# EAGLE schematic 4-20ma (EAGLE 9.2.0)
AUTHOR: Jared Wolff; BOARD_NUMBER: BRD-0005; COMPANY: Circuit Dojo; DOC_NUMBER: SCH-0005; DOC_REV: 1

## Sheet 1 of 2
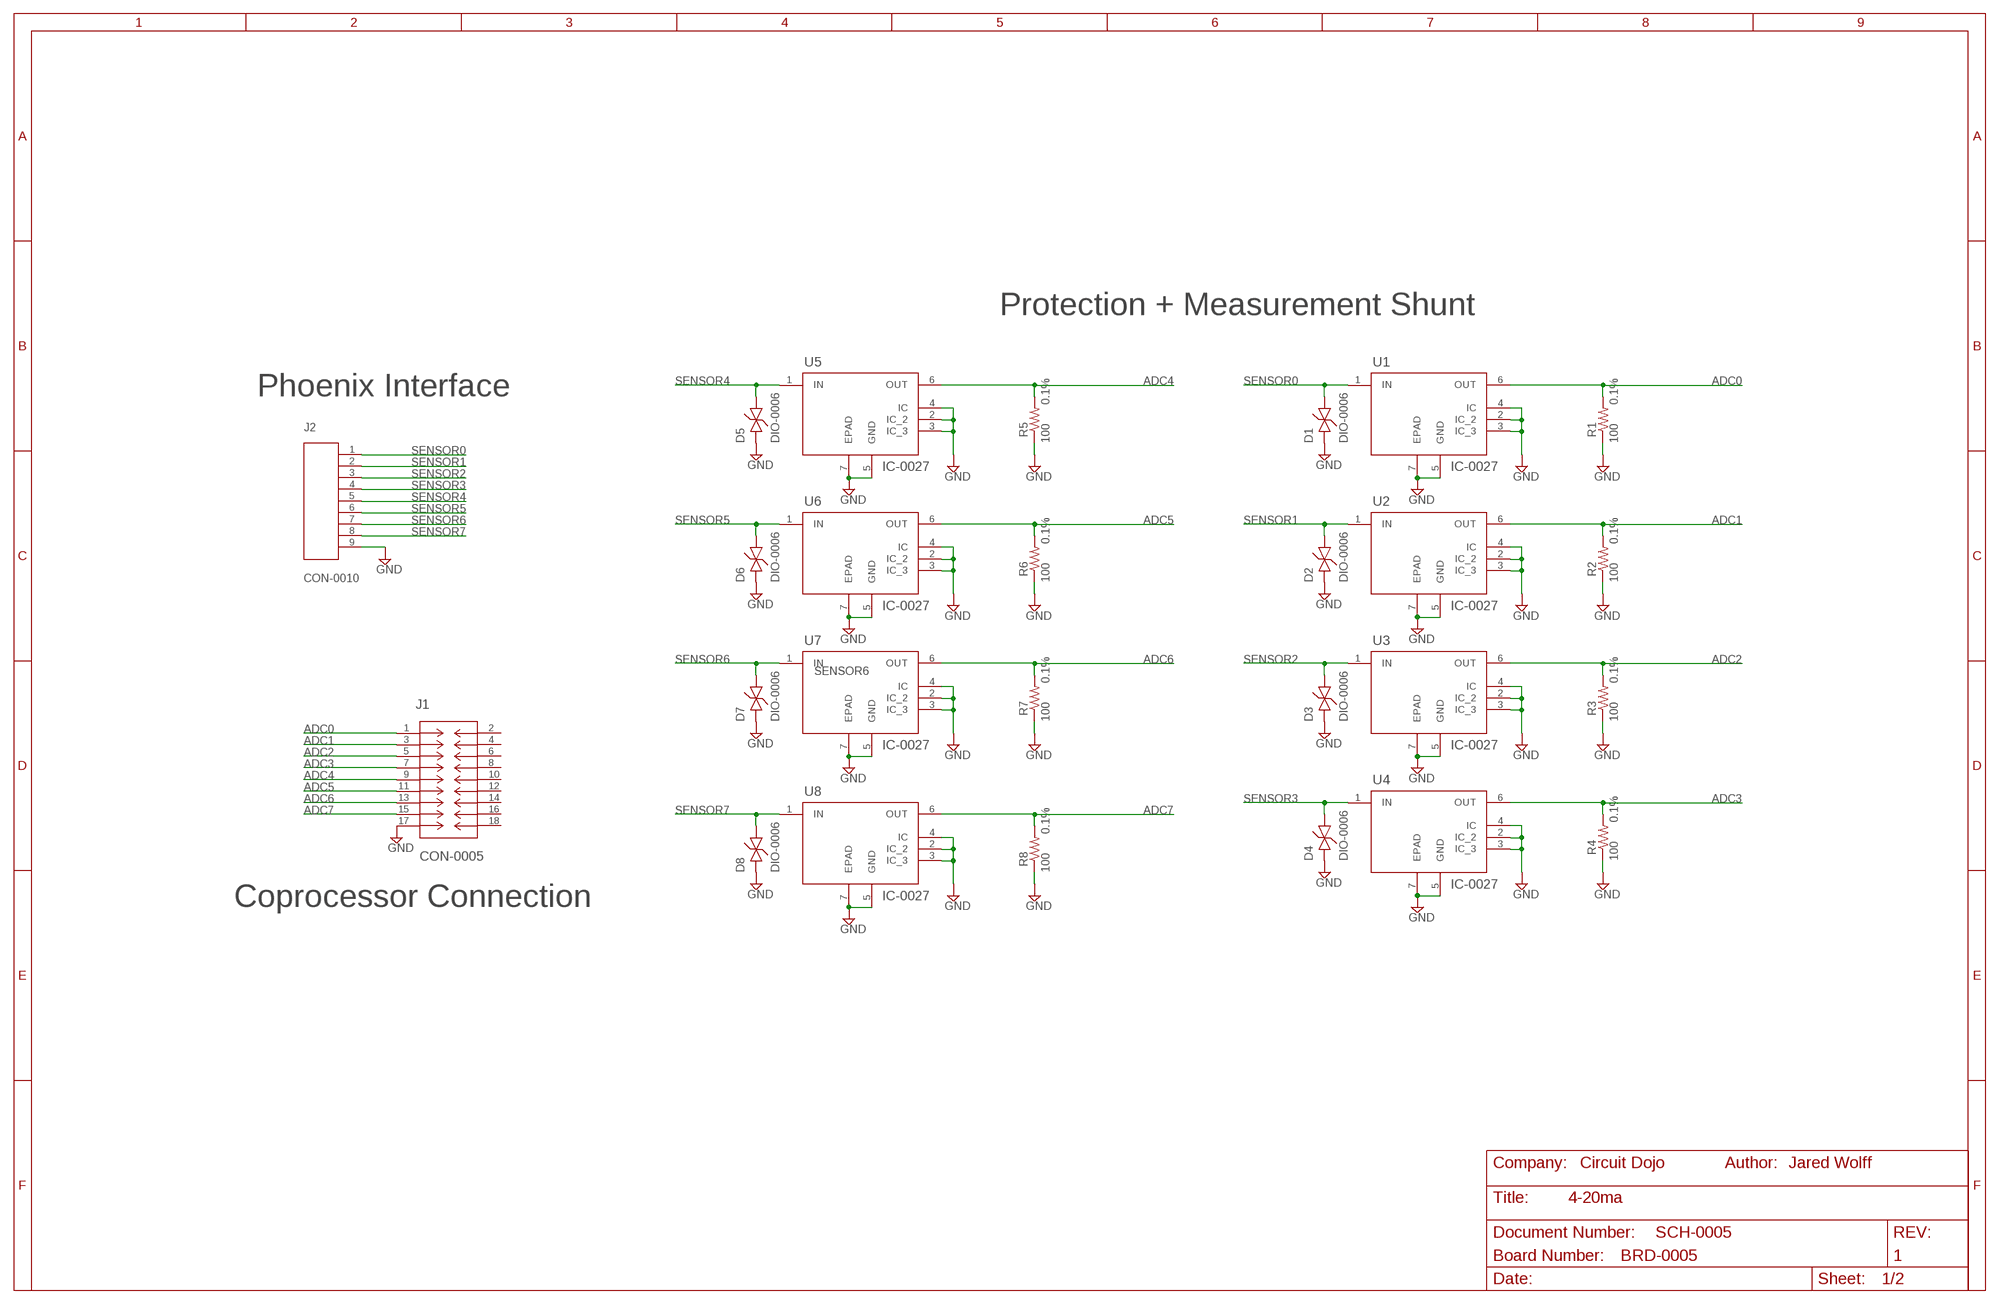
[diagram p0: schematic, sheet 1]

### Parts
D1  DIO-0006  [SMASERIES]
D2  DIO-0006  [SMASERIES]
D3  DIO-0006  [SMASERIES]
D4  DIO-0006  [SMASERIES]
D5  DIO-0006  [SMASERIES]
D6  DIO-0006  [SMASERIES]
D7  DIO-0006  [SMASERIES]
D8  DIO-0006  [SMASERIES]
J1  CON-0005  [CON18_2X9_TU_SSQ]
J2  CON-0010  [CON-B9B-ZR]
R1  100  RES-0034  [R0603]
R2  100  RES-0034  [R0603]
R3  100  RES-0034  [R0603]
R4  100  RES-0034  [R0603]
R5  100  RES-0034  [R0603]
R6  100  RES-0034  [R0603]
R7  100  RES-0034  [R0603]
R8  100  RES-0034  [R0603]
U1  IC-0027  [21-0137I_T633-2]
U2  IC-0027  [21-0137I_T633-2]
U3  IC-0027  [21-0137I_T633-2]
U4  IC-0027  [21-0137I_T633-2]
U5  IC-0027  [21-0137I_T633-2]
U6  IC-0027  [21-0137I_T633-2]
U7  IC-0027  [21-0137I_T633-2]
U8  IC-0027  [21-0137I_T633-2]

### Nets
ADC0: J1.1 R1.2 U1.6(OUT)
ADC1: J1.3 R2.2 U2.6(OUT)
ADC2: J1.5 R3.2 U3.6(OUT)
ADC3: J1.7 R4.2 U4.6(OUT)
ADC4: J1.9 R5.2 U5.6(OUT)
ADC5: J1.11 R6.2 U6.6(OUT)
ADC6: J1.13 R7.2 U7.6(OUT)
ADC7: J1.15 R8.2 U8.6(OUT)
GND: D1.1 D2.1 D3.1 D4.1 D5.1 D6.1 D7.1 D8.1 J1.17 J2.9 R1.1 R2.1 R3.1 R4.1 R5.1 R6.1 R7.1 R8.1 U1.2(IC_2) U1.3(IC_3) U1.4(IC) U1.5(GND) U1.7(EPAD) U2.2(IC_2) U2.3(IC_3) U2.4(IC) U2.5(GND) U2.7(EPAD) U3.2(IC_2) U3.3(IC_3) U3.4(IC) U3.5(GND) U3.7(EPAD) U4.2(IC_2) U4.3(IC_3) U4.4(IC) U4.5(GND) U4.7(EPAD) U5.2(IC_2) U5.3(IC_3) U5.4(IC) U5.5(GND) U5.7(EPAD) U6.2(IC_2) U6.3(IC_3) U6.4(IC) U6.5(GND) U6.7(EPAD) U7.2(IC_2) U7.3(IC_3) U7.4(IC) U7.5(GND) U7.7(EPAD) U8.2(IC_2) U8.3(IC_3) U8.4(IC) U8.5(GND) U8.7(EPAD) ; also sheet 2
SENSOR0: D1.2 J2.1 U1.1(IN)
SENSOR1: D2.2 J2.2 U2.1(IN)
SENSOR2: D3.2 J2.3 U3.1(IN)
SENSOR3: D4.2 J2.4 U4.1(IN)
SENSOR4: D5.2 J2.5 U5.1(IN)
SENSOR5: D6.2 J2.6 U6.1(IN)
SENSOR6: D7.2 J2.7 U7.1(IN)
SENSOR7: D8.2 J2.8 U8.1(IN)
Unconnected: J1.2 J1.4 J1.6 J1.8 J1.10 J1.12 J1.14 J1.16 J1.18

### Notes on the sheet
- Protection + Measurement Shunt
- Phoenix Interface
- Coprocessor Connection

## Sheet 2 of 2
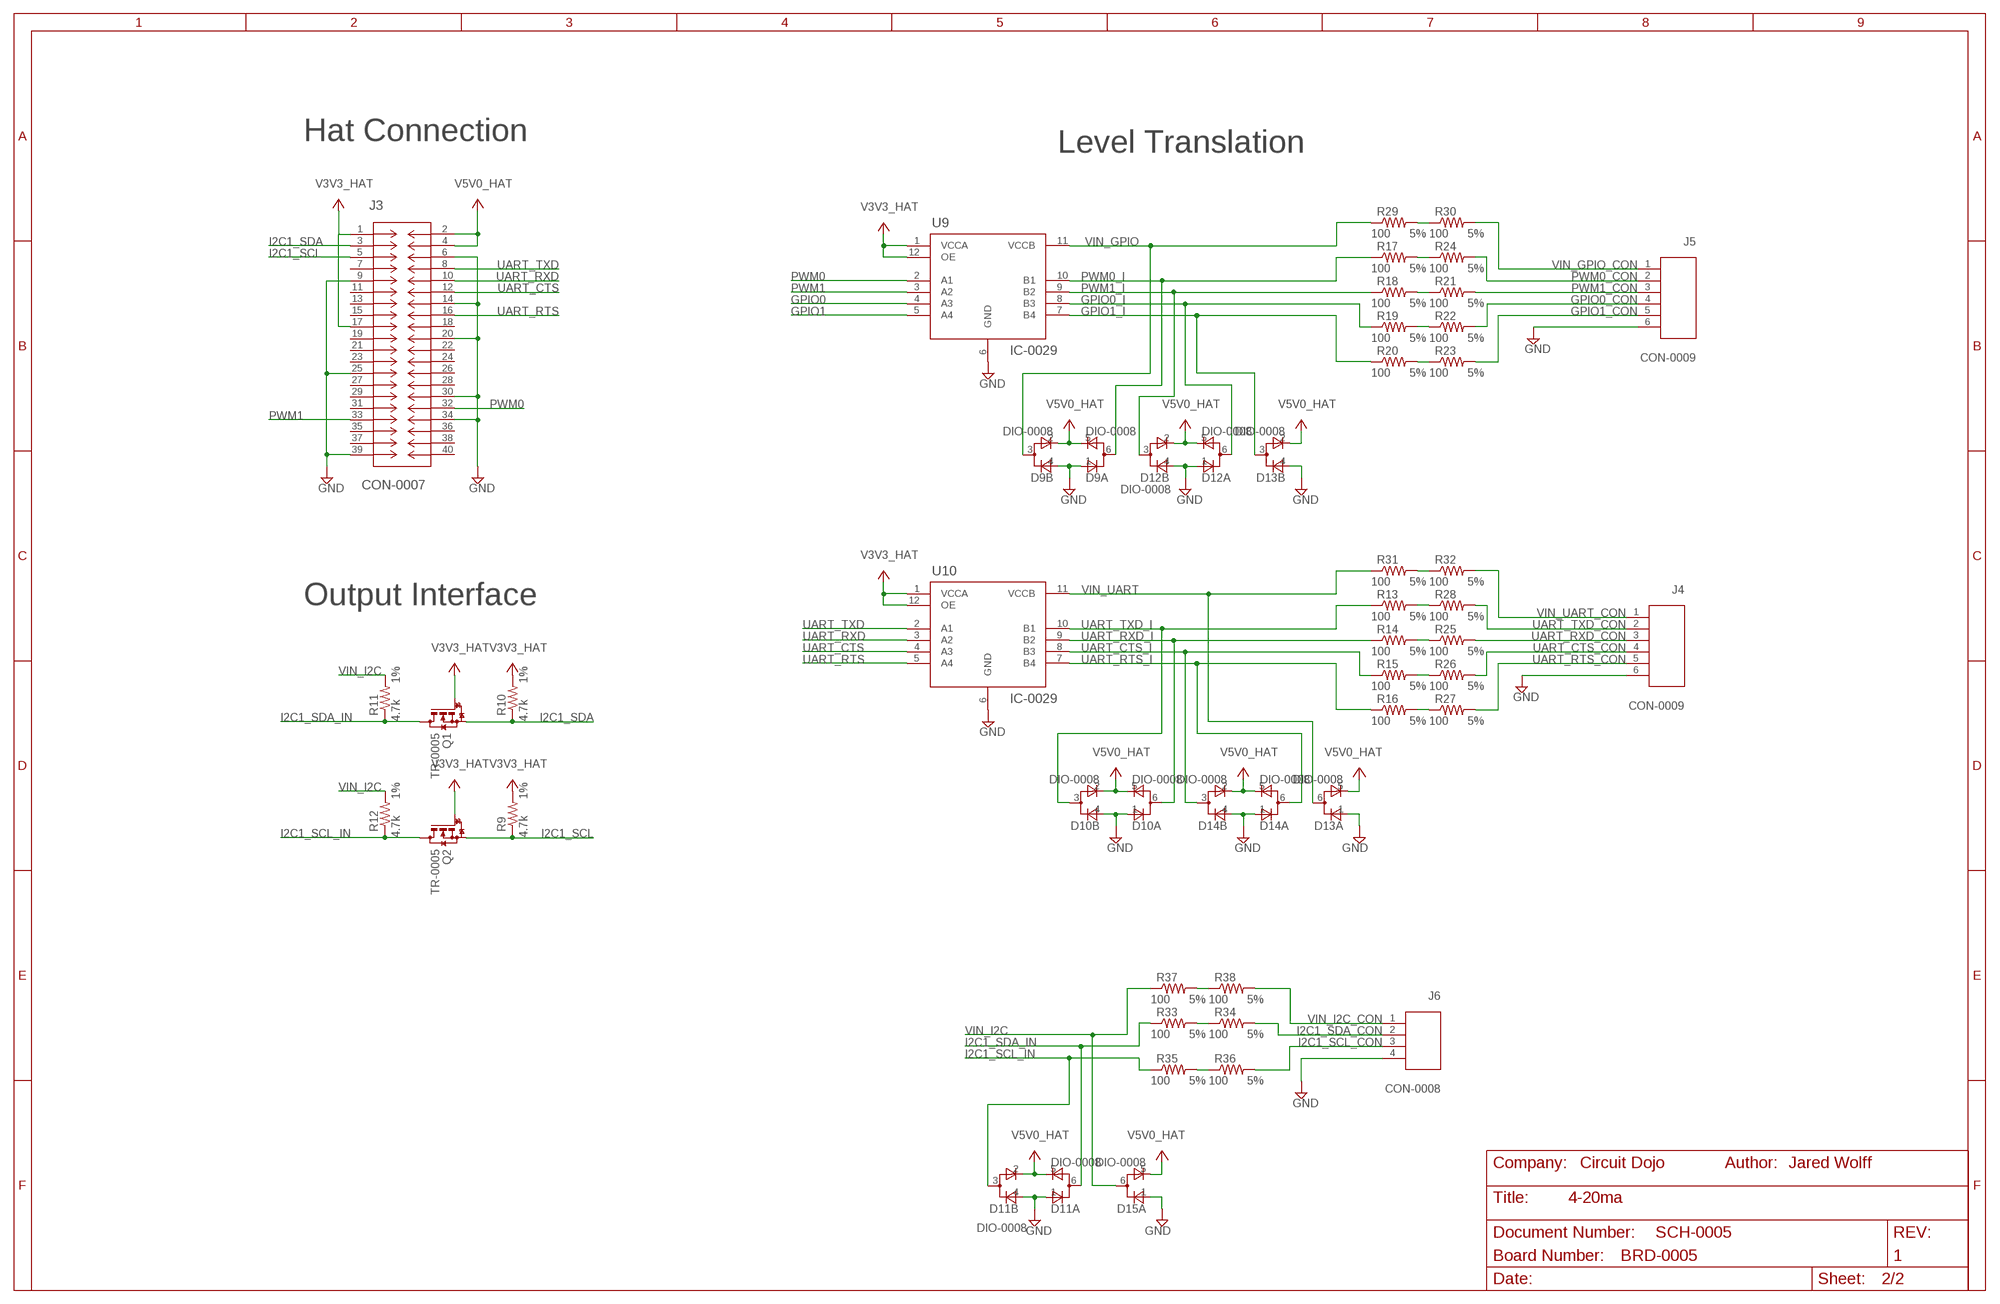
[diagram p1: schematic, sheet 2]

### Parts
D9  DIO-0008  [SOT-563]
D10  DIO-0008  [SOT-563]
D11  DIO-0008  [SOT-563]
D12  DIO-0008  [SOT-563]
D13  DIO-0008  [SOT-563]
D14  DIO-0008  [SOT-563]
D15  DIO-0008  [SOT-563]
J3  CON-0007  [CON40_2X20_TU_SSQ]
J4  CON-0009  [CON-S6B-ZR]
J5  CON-0009  [CON-S6B-ZR]
J6  CON-0008  [CON-S4B-ZR]
Q1  TR-0005  [SOT323]
Q2  TR-0005  [SOT323]
R9  4.7k  RES-0028  [R0603]
R10  4.7k  RES-0028  [R0603]
R11  4.7k  RES-0028  [R0603]
R12  4.7k  RES-0028  [R0603]
R13  100  RES-0035  [R0603]
R14  100  RES-0035  [R0603]
R15  100  RES-0035  [R0603]
R16  100  RES-0035  [R0603]
R17  100  RES-0035  [R0603]
R18  100  RES-0035  [R0603]
R19  100  RES-0035  [R0603]
R20  100  RES-0035  [R0603]
R21  100  RES-0035  [R0603]
R22  100  RES-0035  [R0603]
R23  100  RES-0035  [R0603]
R24  100  RES-0035  [R0603]
R25  100  RES-0035  [R0603]
R26  100  RES-0035  [R0603]
R27  100  RES-0035  [R0603]
R28  100  RES-0035  [R0603]
R29  100  RES-0035  [R0603]
R30  100  RES-0035  [R0603]
R31  100  RES-0035  [R0603]
R32  100  RES-0035  [R0603]
R33  100  RES-0035  [R0603]
R34  100  RES-0035  [R0603]
R35  100  RES-0035  [R0603]
R36  100  RES-0035  [R0603]
R37  100  RES-0035  [R0603]
R38  100  RES-0035  [R0603]
U9  IC-0029  [RUT12]
U10  IC-0029  [RUT12]

### Nets
GND: D9.1(A:A) D9.4(B:A) D10.1(A:A) D10.4(B:A) D11.1(A:A) D11.4(B:A) D12.1(A:A) D12.4(B:A) D13.1(A:A) D13.4(B:A) D14.1(A:A) D14.4(B:A) D15.1(A:A) J3.6 J3.9 J3.14 J3.20 J3.25 J3.30 J3.34 J3.39 J4.6 J5.6 J6.4 U9.6(GND) U10.6(GND) ; also sheet 1
GPIO0: U9.4(A3)
GPIO0_CON: J5.4 R22.2
GPIO0_I: D12.6(A:AC) R19.1 U9.8(B3)
GPIO0_II: R19.2 R22.1
GPIO1: U9.5(A4)
GPIO1_CON: J5.5 R23.2
GPIO1_I: D13.3(B:AC) R20.1 U9.7(B4)
GPIO1_II: R20.2 R23.1
I2C1_SCL: J3.5 Q2.S R9.1
I2C1_SCL_CON: J6.3 R36.2
I2C1_SCL_IN: D11.3(B:AC) Q2.D R12.1 R35.1
I2C1_SDA: J3.3 Q1.S R10.1
I2C1_SDA_CON: J6.2 R34.2
I2C1_SDA_IN: D11.6(A:AC) Q1.D R11.1 R33.1
N$1: R13.2 R28.1
N$2: R14.2 R25.1
N$3: R15.2 R26.1
N$4: R16.2 R27.1
PWM0: J3.32 U9.2(A1)
PWM0_CON: J5.2 R24.2
PWM0_I: D9.6(A:AC) R17.1 U9.10(B1)
PWM0_II: R17.2 R24.1
PWM0_II1: R29.2 R30.1
PWM0_II2: R31.2 R32.1
PWM0_II3: R33.2 R34.1
PWM0_II4: R35.2 R36.1
PWM0_II5: R37.2 R38.1
PWM1: J3.33 U9.3(A2)
PWM1_CON: J5.3 R21.2
PWM1_I: D12.3(B:AC) R18.1 U9.9(B2)
PWM1_II: R18.2 R21.1
UART_CTS: J3.12 U10.4(A3)
UART_CTS_CON: J4.4 R26.2
UART_CTS_I: D14.3(B:AC) R15.1 U10.8(B3)
UART_RTS: J3.16 U10.5(A4)
UART_RTS_CON: J4.5 R27.2
UART_RTS_I: D14.6(A:AC) R16.1 U10.7(B4)
UART_RXD: J3.10 U10.3(A2)
UART_RXD_CON: J4.3 R25.2
UART_RXD_I: D10.6(A:AC) R14.1 U10.9(B2)
UART_TXD: J3.8 U10.2(A1)
UART_TXD_CON: J4.2 R28.2
UART_TXD_I: D10.3(B:AC) R13.1 U10.10(B1)
V3V3_HAT: J3.1 J3.17 Q1.G Q2.G R9.2 R10.2 U9.1(VCCA) U9.12(OE) U10.1(VCCA) U10.12(OE)
V5V0_HAT: D9.2(B:C) D9.5(A:C) D10.2(B:C) D10.5(A:C) D11.2(B:C) D11.5(A:C) D12.2(B:C) D12.5(A:C) D13.2(B:C) D13.5(A:C) D14.2(B:C) D14.5(A:C) D15.5(A:C) J3.2 J3.4
VIN_GPIO: D9.3(B:AC) R29.1 U9.11(VCCB)
VIN_GPIO_CON: J5.1 R30.2
VIN_I2C: D15.6(A:AC) R11.2 R12.2 R37.1
VIN_I2C_CON: J6.1 R38.2
VIN_UART: D13.6(A:AC) R31.1 U10.11(VCCB)
VIN_UART_CON: J4.1 R32.2
Unconnected: D15.2(B:C) D15.3(B:AC) D15.4(B:A) J3.7 J3.11 J3.13 J3.15 J3.18 J3.19 J3.21 J3.22 J3.23 J3.24 J3.26 J3.27 J3.28 J3.29 J3.31 J3.35 J3.36 J3.37 J3.38 J3.40

### Notes on the sheet
- Hat Connection
- Level Translation
- Output Interface

## Library data of the parts
D1-D8 = wolff-den:DIO-0006: TVS DIODE 13V 21.5V DO214AC
D9-D15 = wolff-den:DIO-0008: Diode Array 2 Pair Series Connection Standard 75V 215mA (DC) Surface Mount SOT-563, SOT-666; DIGIKEYPN: BAV99BRVA-7DITR-ND; MPN: BAV99BRVA7; VENDOR: Diodes Inc
J1 = wolff-den:CON-0005: DIL VERTICAL PC TAIL SOCKET ASSY; DIGIKEYPN: 952-2148-ND; MPN: M20-7830942
J2 = wolff-den:CON-0010: CONN HEADER ZH TOP 9POS 1.5MM; DIGIKEYPN: 455-1664-ND; MPN: B9B-ZR(LF)(SN)
J3 = wolff-den:CON-0007: DIL VERTICAL PC TAIL SOCKET ASSY; DIGIKEYPN: 952-2149-ND; MPN: M20-7832042
J4 J5 = wolff-den:CON-0009: CONN HEADER ZH SIDE 6POS 1.5MM; DIGIKEYPN: 455-1673-ND; MPN: S6B-ZR(LF)(SN)
J6 = wolff-den:CON-0008: CONN HEADER ZH SIDE 4POS 1.5MM; DIGIKEYPN: 455-1671-ND; MPN: S4B-ZR(LF)(SN)
Q1 Q2 = wolff-den:TR-0005: MOSFET N-CH 30V 180MA SOT323; DIGIKEYPN: 1727-1288-1-ND; MPN: NX3020NAKW,115
R1-R8 = wolff-den:RES-0034: RES SMD 100 OHM 0.1% 1/10W 0603; DIGIKEYPN: P100DBCT-ND; MPN: ERA-3AEB101V; TEMPHIGH: 155; TEMPLOW: -55; TOLERANCE: 0.1%
R9-R12 = wolff-den:RES-0028: RES SMD 4.7K OHM 1% 1/10W 0603; DIGIKEYPN: RMCF0603FT4K70CT-ND; MPN: RMCF0603FT4K70; TEMPHIGH: 155; TEMPLOW: -55; TOLERANCE: 1%
R13-R38 = wolff-den:RES-0035: RES SMD 1K OHM 5% 1/4W 0603; DIGIKEYPN: RHM1.0KDCT-ND; MPN: ESR03EZPJ102; TEMPHIGH: 155; TEMPLOW: -55; TOLERANCE: 5%
U1-U8 = wolff-den:IC-0027: IC CURR LOOP PROT 4-20MA 6TDFN; DIGIKEYPN: MAX14626ETT+TCT-ND; MPN: MAX14626ETT+T
U9 U10 = wolff-den:IC-0029: IC TRNSLTR BIDIRECTIONAL 12UQFN; DIGIKEYPN: 296-41033-1-ND; MPN: TXB0104QRUTRQ1; VENDOR: Texas Instruments